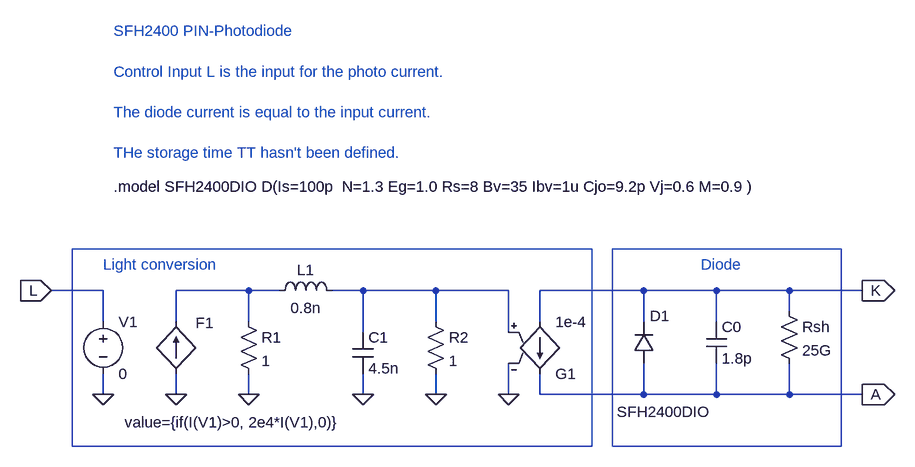
[diagram p0: schematic sfh2400_hy.asc]
sfh2400_hy.asc, the LTspice schematic file:
Version 4
SHEET 1 1668 1860
WIRE -272 512 -352 512
WIRE -272 560 -272 512
WIRE -272 672 -272 640
WIRE -160 560 -160 512
WIRE -160 672 -160 640
WIRE -48 512 -160 512
WIRE -48 560 -48 512
WIRE -48 672 -48 640
WIRE 0 512 -48 512
WIRE 128 512 80 512
WIRE 128 576 128 512
WIRE 128 672 128 640
WIRE 240 512 128 512
WIRE 240 560 240 512
WIRE 240 672 240 640
WIRE 352 512 240 512
WIRE 352 576 352 512
WIRE 352 672 352 624
WIRE 400 560 400 512
WIRE 400 672 400 640
WIRE 560 512 400 512
WIRE 560 560 560 512
WIRE 560 672 400 672
WIRE 560 672 560 624
WIRE 672 512 560 512
WIRE 672 560 672 512
WIRE 672 672 560 672
WIRE 672 672 672 624
WIRE 784 512 672 512
WIRE 784 544 784 512
WIRE 784 672 672 672
WIRE 784 672 784 624
WIRE 896 512 784 512
WIRE 896 672 784 672
FLAG -272 672 0
FLAG -160 672 0
FLAG -48 672 0
FLAG 128 672 0
FLAG 352 672 0
FLAG 240 672 0
FLAG -352 512 L
IOPIN -352 512 In
FLAG 896 512 K
IOPIN 896 512 Out
FLAG 896 672 A
IOPIN 896 672 Out
SYMBOL cap 656 560 R0
SYMATTR InstName C0
SYMATTR Value 1.8p
SYMBOL res 768 528 R0
SYMATTR InstName Rsh
SYMATTR Value 25G
SYMBOL voltage -272 544 R0
SYMATTR InstName V1
SYMATTR Value 0
SYMBOL f -160 640 R180
WINDOW 0 -59 78 Left 0
WINDOW 3 -254 -75 Left 0
SYMATTR InstName F1
SYMATTR Value value={if(I(V1)>0, 2e4*I(V1),0)}
SYMBOL res -64 544 R0
SYMATTR InstName R1
SYMATTR Value 1
SYMBOL cap 112 576 R0
SYMATTR InstName C1
SYMATTR Value 4.5n
SYMBOL g2 400 656 M180
SYMATTR InstName G1
SYMATTR Value 1e-4
SYMBOL ind -16 528 R270
WINDOW 0 32 56 VTop 0
WINDOW 3 5 56 VBottom 0
SYMATTR InstName L1
SYMATTR Value 0.8n
SYMBOL res 224 544 R0
SYMATTR InstName R2
SYMATTR Value 1
SYMBOL diode 576 624 R180
WINDOW 0 -24 73 Left 0
WINDOW 3 -87 -75 Left 0
SYMATTR InstName D1
SYMATTR Value SFH2400DIO
TEXT -256 352 Left 0 !.model SFH2400DIO D(Is=100p  N=1.3 Eg=1.0 Rs=8 Bv=35 Ibv=1u Cjo=9.2p Vj=0.6 M=0.9 )
TEXT -256 112 Left 0 ;SFH2400 PIN-Photodiode\n \nControl Input L is the input for the photo current.\n \nThe diode current is equal to the input current.\n \nTHe storage time TT hasn't been defined.
TEXT 648 472 Left 0 ;Diode
TEXT -272 472 Left 0 ;Light conversion
RECTANGLE Normal 480 752 -320 448
RECTANGLE Normal 864 752 512 448

The netlist it stands for:
* sfh2400_hy.asc
C0 K A 1.8p
Rsh K A 25G
V1 L 0 0
F1 0 N001 value={if(I(V1)>0, 2e4*I(V1),0)}
R1 N001 0 1
C1 N002 0 4.5n
G1 K A N002 0 1e-4
L1 N001 N002 0.8n
R2 N002 0 1
D1 A K SFH2400DIO
.model D D
.lib standard.dio
.model SFH2400DIO D(Is=100p  N=1.3 Eg=1.0 Rs=8 Bv=35 Ibv=1u Cjo=9.2p Vj=0.6 M=0.9 )
* SFH2400 PIN-Photodiode
* Control Input L is the input for the photo current.
* The diode current is equal to the input current.
* THe storage time TT hasn't been defined.
* Diode
* Light conversion
.backanno
.end